# EAGLE design machxo2-breakout-v2 (EAGLE 9.4.2)
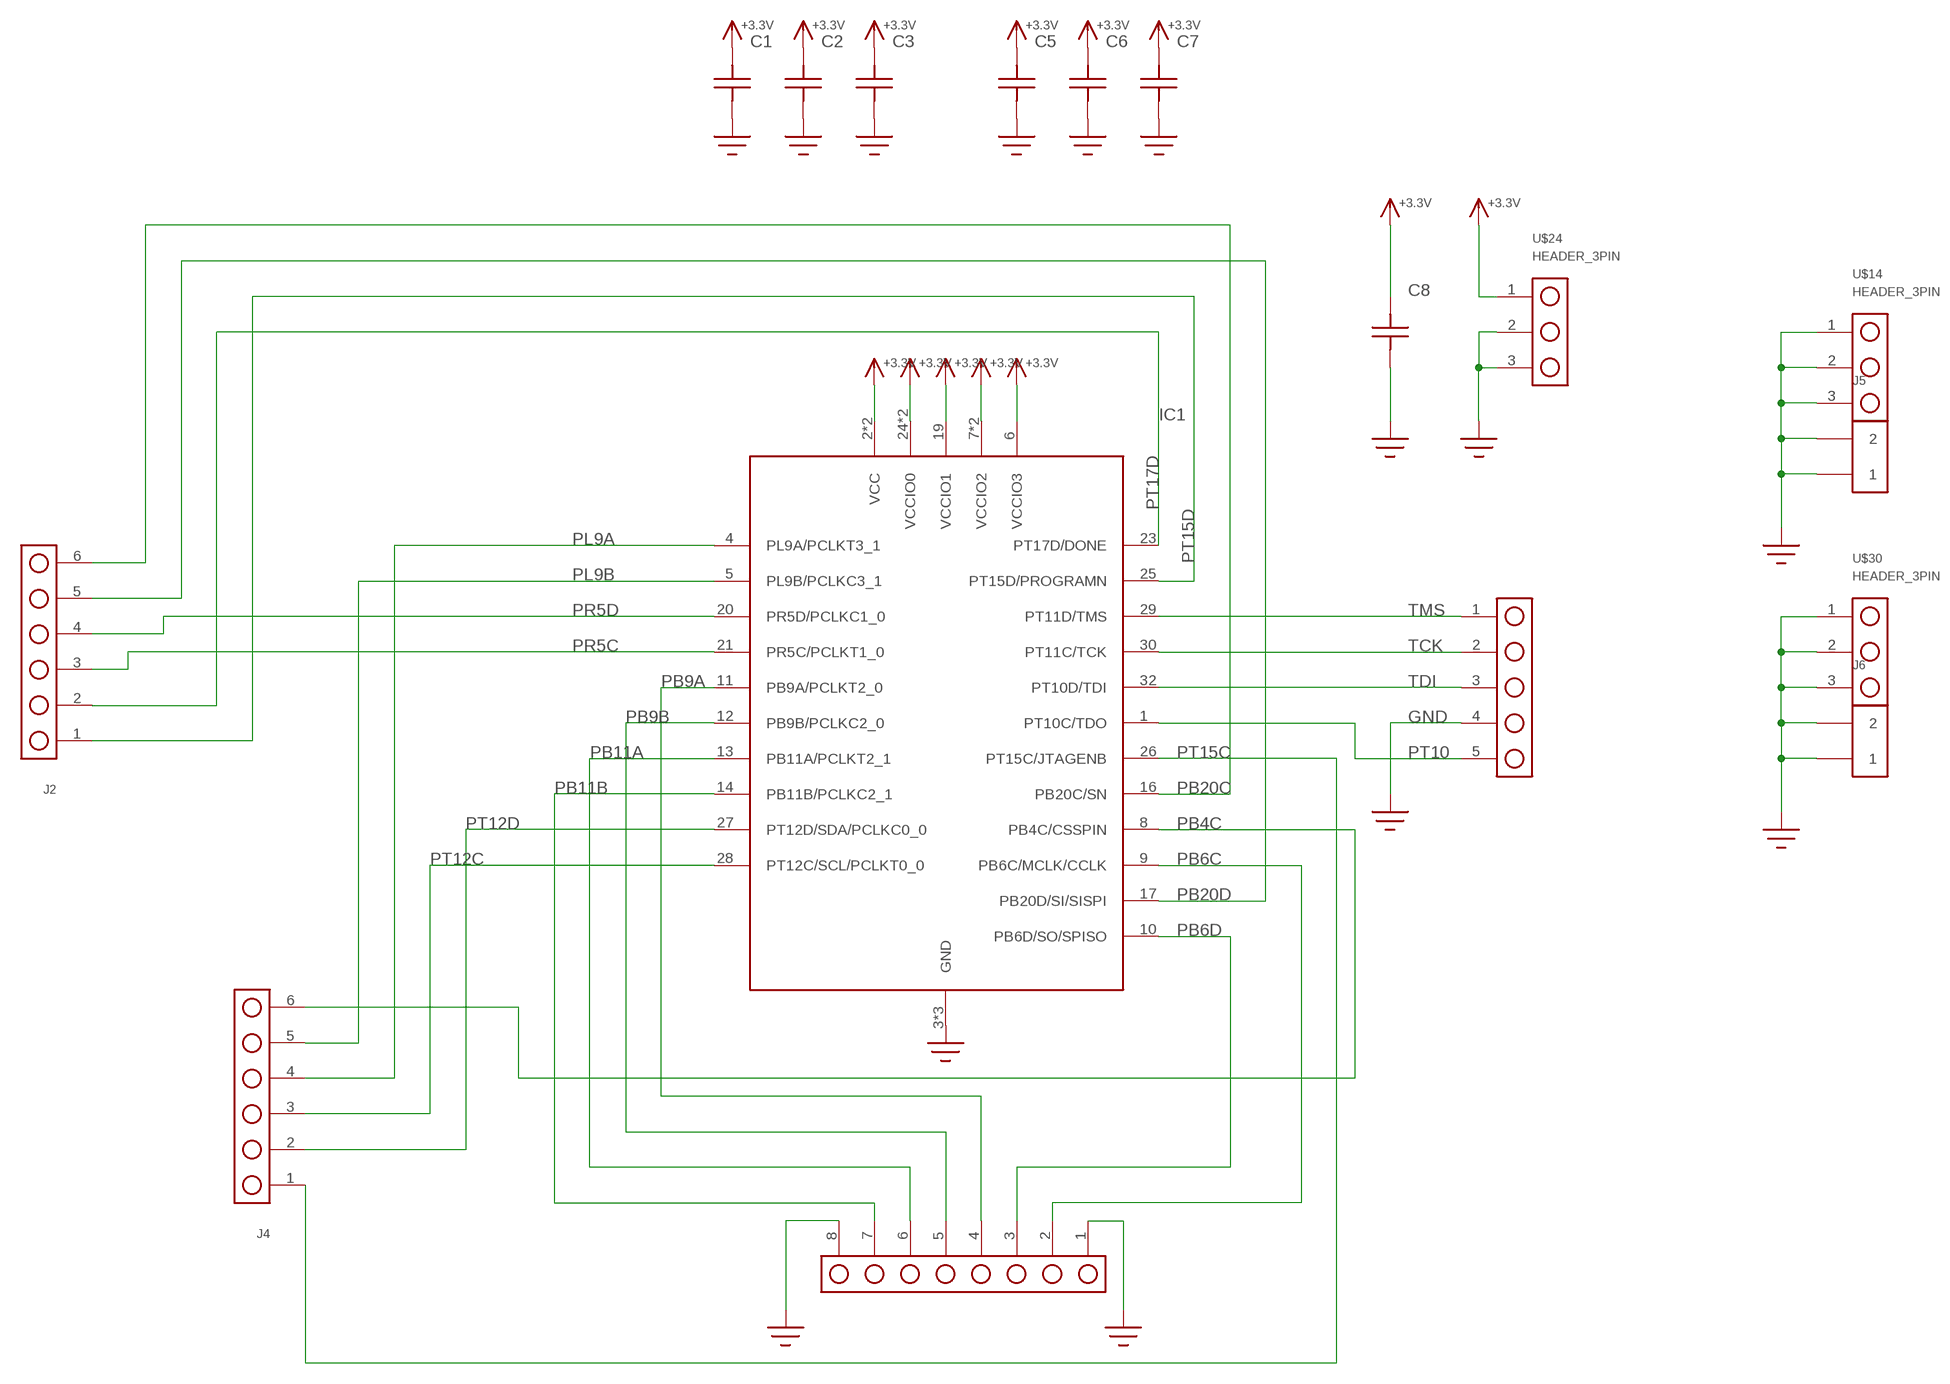
[diagram p0: schematic, sheet 1]

## Parts
C1  C  [C0402]
C2  C  [C0402]
C3  C  [C0402]
C5  C  [C0402]
C6  C  [C0402]
C7  C  [C0402]
C8  C1206  [1206]
IC1  MACHXO2_1200EXTENDED  [QFN32_5X5-EXTENDED]
J1  HEADER_5PIN  [HEADER_5PIN]
J2  HEADER_6PIN  [HEADER_6PIN]
J3  HEADER_8PIN  [HEADER_8_PIN]
J4  HEADER_6PIN  [HEADER_6PIN]
J5  HEADER_2PIN  [HEADER_2PIN]
J6  HEADER_2PIN  [HEADER_2PIN]
U$14  HEADER_3PIN  [HEADER_3PIN]
U$24  HEADER_3PIN  [HEADER_3PIN]
U$30  HEADER_3PIN  [HEADER_3PIN]

## Nets
+3.3V: C1.2 C2.2 C3.2 C5.2 C6.2 C7.2 C8.P$2 IC1.2(VCC) IC1.6(VCCIO3) IC1.7(VCCIO2) IC1.15(VCCIO2) IC1.18(VCC) IC1.19(VCCIO1) IC1.24(VCCIO0) IC1.31(VCCIO0) U$24.1
GND: C1.1 C2.1 C3.1 C5.1 C6.1 C7.1 C8.P$1 IC1.3(GND) IC1.22(GND) IC1.PAD(GND) J1.4 J3.1 J3.8 J5.1 J5.2 J6.1 J6.2 U$14.1 U$14.2 U$14.3 U$24.2 U$24.3 U$30.1 U$30.2 U$30.3
PB4C: IC1.8(PB4C/CSSPIN) J4.6
PB6C: IC1.9(PB6C/MCLK/CCLK) J3.2
PB6D: IC1.10(PB6D/SO/SPISO) J3.3
PB9A: IC1.11(PB9A/PCLKT2_0) J3.4
PB9B: IC1.12(PB9B/PCLKC2_0) J3.5
PB11A: IC1.13(PB11A/PCLKT2_1) J3.6
PB11B: IC1.14(PB11B/PCLKC2_1) J3.7
PB20C: IC1.16(PB20C/SN) J2.6
PB20D: IC1.17(PB20D/SI/SISPI) J2.5
PL9A: IC1.4(PL9A/PCLKT3_1) J4.4
PL9B: IC1.5(PL9B/PCLKC3_1) J4.5
PR5C: IC1.21(PR5C/PCLKT1_0) J2.3
PR5D: IC1.20(PR5D/PCLKC1_0) J2.4
PT10: IC1.1(PT10C/TDO) J1.5
PT12C: IC1.28(PT12C/SCL/PCLKT0_0) J4.3
PT12D: IC1.27(PT12D/SDA/PCLKC0_0) J4.2
PT15C: IC1.26(PT15C/JTAGENB) J4.1
PT15D: IC1.25(PT15D/PROGRAMN) J2.1
PT17D: IC1.23(PT17D/DONE) J2.2
TCK: IC1.30(PT11C/TCK) J1.2
TDI: IC1.32(PT10D/TDI) J1.3
TMS: IC1.29(PT11D/TMS) J1.1

## Library data of the parts
C1-C3 C5-C8 = yapo:C
IC1 = yapo:MACHXO2_1200
J1 = yapo:HEADER_5PIN
J2 J4 = yapo:HEADER_6PIN
J3 = yapo:HEADER_8PIN
J5 J6 = yapo:HEADER_2PIN
U$14 U$24 U$30 = yapo:HEADER_3PIN

## Board
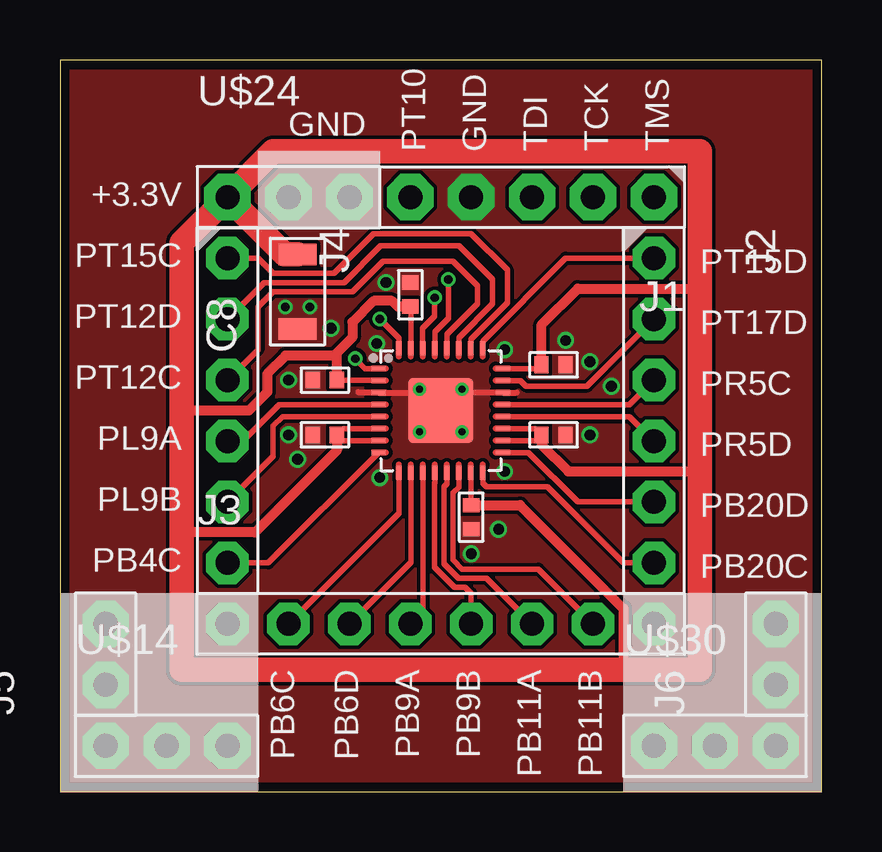
[diagram p1: board, top side]
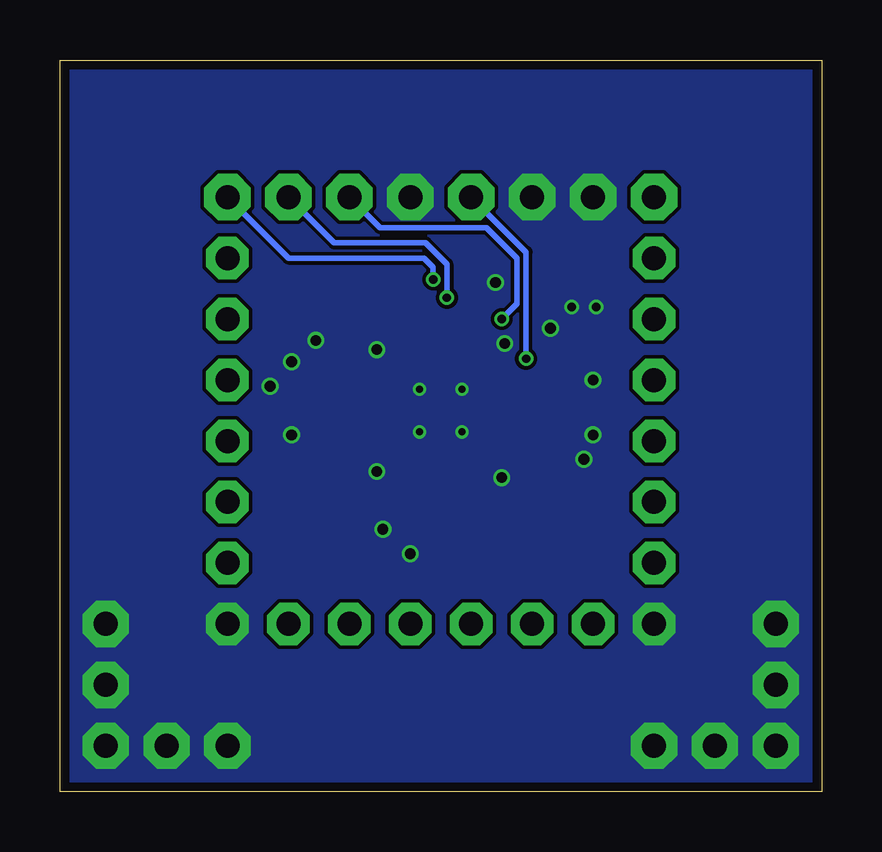
[diagram p2: board, bottom side, seen from below]

Size 31.75 x 30.48 mm. Coordinates in mm from the lower left corner, seen from the top.
Outline: 0,0 31.75,0 31.75,30.48 0,30.48 0,0
Copper layers (1*16): Top 0.035559375mm / dielectric 1.6mm / Bottom 0.035559375mm
Design rules "oshpark-2layer *": minimum track width 6mil, minimum drill 10mil, track to track 6mil, track to pad 6mil, pad to pad 6mil, via to via 6mil, smd to smd 6mil, copper to edge 15mil, drill to drill 6mil, minimum pad ring 5mil, minimum via ring 5mil, stop-mask expansion 2.5mil, vias tented up to drill 20mil, thermal gap 10mil

### Footprints (pad centres in the part's own frame; a part is rotated, then mirrored left to right if it is on the bottom)
C0402 = smd 0.6 x 0.7: 1 -0.5,0; 2 0.5,0
1206 = smd 0.9 x 1.6: P$1 -1.55,0; P$2 1.55,0
QFN32_5X5-EXTENDED = smd 0.6 x 0.24: 1 -2.594,1.75; 2 -2.594,1.25; 3 -2.594,0.75; 4 -2.594,0.25; 5 -2.594,-0.25; 6 -2.594,-0.75; 7 -2.594,-1.25; 8 -2.594,-1.75; 17 2.594,-1.75; 18 2.594,-1.25; 19 2.594,-0.75; 20 2.594,-0.25; 21 2.594,0.25; 22 2.594,0.75; 23 2.594,1.25; 24 2.594,1.75 | smd 0.24 x 0.6: 9 -1.75,-2.594; 10 -1.25,-2.594; 11 -0.75,-2.594; 12 -0.25,-2.594; 13 0.25,-2.594; 14 0.75,-2.594; 15 1.25,-2.594; 16 1.75,-2.594; 25 1.75,2.594; 26 1.25,2.594; 27 0.75,2.594; 28 0.25,2.594; 29 -0.25,2.594; 30 -0.75,2.594; 31 -1.25,2.594; 32 -1.75,2.594 | smd 2.7 x 2.7: PAD 0,0
HEADER_5PIN = drill 1 pad 1.93 octagon: 1 -5.08,0; 2 -2.54,0; 3 0,0; 4 2.54,0; 5 5.08,0
HEADER_6PIN = drill 1 pad 1.778 octagon: 1 -6.35,0; 2 -3.81,0; 3 -1.27,0; 4 1.27,0; 5 3.81,0; 6 6.35,0
HEADER_8_PIN = drill 1 pad 1.778 octagon: 1 -8.89,0; 2 -6.35,0; 3 -3.81,0; 4 -1.27,0; 5 1.27,0; 6 3.81,0; 7 6.35,0; 8 8.89,0
HEADER_2PIN = drill 1 pad 1.93 octagon: 1 -1.27,0; 2 1.27,0
HEADER_3PIN = drill 1 pad 1.93 octagon: 1 -2.54,0; 2 0,0; 3 2.54,0

### Placement (x,y rotation side)
C1  11.05,14.86 0 top
C2  11.05,17.14 0 top
C3  20.57,17.78 180 top
C5  14.61,20.7 270 top
C6  20.57,14.86 180 top
C7  17.14,11.43 90 top
C8  9.91,20.83 90 top
IC1  15.88,15.88 0 top
J1  19.68,24.77 180 top
J2  24.77,15.88 270 top
J3  15.88,6.99 0 top
J4  6.99,15.88 270 top
J5  1.91,5.71 90 top
J6  29.84,5.71 90 top
U$14  4.45,1.91 0 top
U$24  9.53,24.77 0 top
U$30  27.3,1.91 0 top

### Tracks (layer width: path | path; a pad name or v marks a point on that pad's centre or on a via)
+3.3V
  Top 0.229: IC1.31 14.62,20.18 C5.2 | IC1.2 13.26,17.14 C2.2 | IC1.24 19.92,17.62 C3.2 | IC1.18 19.84,14.62 C6.2 19.81,15.12 IC1.19 | IC1.6 11.81,15.12 C1.2 11.78,14.62 IC1.7 | IC1.15 17.14,13.26 C7.2
  Top 0.406: C2.2 11.55,18.28 11.56,18.29 | 11.56,18.29 11.43,18.16 9.4,18.16 8.64,17.4 8.64,16.64 7.87,15.88 5.08,15.88 | 11.56,18.29 11.68,18.41 12.19,18.92 12.19,19.56 13.08,20.45 13.84,20.45 14.09,20.2 C5.2 | C1.2 11.55,14.22 8.13,10.79 5.08,10.79 | C7.2 19.18,11.93 23.5,7.62 23.5,5.08 | C6.2 20.07,14.45 21.19,13.34 26.67,13.34 | C3.2 20.07,19.44 21.59,20.95 26.67,20.95
  Top 1.016: U$24.1 9.37,22.38 C8.P$2 | U$24.1 5.08,22.86 5.08,15.88 5.08,10.79 5.08,5.08 23.5,5.08 26.67,5.08 26.67,13.34 26.67,20.95 26.67,26.67 8.89,26.67 U$24.1
GND  (via drill 0.3, 0.35, 0.45)
  Top 0.254: v16.76,16.76 16.9,16.62 IC1.22 19.04,16.62 | v14.99,16.76 14.85,16.62 IC1.3 12.46,16.62 12.45,16.64
  other vias: 9.53,17.14 9.53,14.86 22.1,17.91 13.59,21.21 22.1,14.86 17.14,9.91 16.76,14.99 14.99,14.99 9.4,20.19 10.41,20.19 11.3,19.3 22.99,16.89 18.54,18.41 13.21,18.67 18.54,13.34 13.34,13.08 9.91,13.84 18.29,10.92 21.08,18.8
  pour Top (no thermals): 0,0 31.75,0 31.75,30.48 0,30.48
  pour Bottom (no thermals): 0,0 31.75,0 31.75,30.48 0,30.48
  cutout Top: 13.34,16.89 12.7,16.89 12.7,16.38 13.34,16.38
  cutout Top: 19.05,16.89 18.41,16.89 18.41,16.38 19.05,16.38
PB4C
  Top 0.229: IC1.8 8.68,9.53 J4.6
PB6C
  Top 0.229: IC1.9 14.12,11.59 J3.2
PB6D
  Top 0.229: IC1.10 14.62,9.54 J3.3
PB9A
  Top 0.229: IC1.11 15.12,7.5 J3.4
PB9B
  Top 0.229: J3.5 17.14,8.26 16.89,8.51 16.45,8.51 15.62,9.34 15.62,12.86 IC1.12
PB11A
  Top 0.229: J3.6 17.78,8.89 16.61,8.89 16,9.49 16,12.7 16.12,12.82 IC1.13
PB11B
  Top 0.229: IC1.14 16.62,12.69 16.38,12.45 16.38,9.65 16.76,9.27 19.94,9.27 J3.7
PB20C
  Top 0.229: IC1.16 17.62,12.86 17.78,12.7 20.32,12.7 23.5,9.53 J2.6
PB20D
  Top 0.229: IC1.17 19.53,14.12 21.59,12.06 J2.5
PL9A
  Top 0.229: IC1.4 9.14,16.12 7.62,14.61 J4.4
PL9B
  Top 0.229: IC1.5 9.28,15.62 8.89,15.24 8.89,13.97 J4.5
PR5C
  Top 0.229: IC1.21 23.75,16.12 J2.3
PR5D
  Top 0.229: IC1.20 23.75,15.62 J2.4
PT10  (via drill 0.35)
  Top 0.229: IC1.1 12.73,17.62 v12.32,18.03
  Bottom 0.229: v12.32,18.03 12.32,22.48 J1.5
PT12C
  Top 0.229: IC1.28 16.12,19.05 17.4,20.32 17.4,21.08 16.38,22.1 13.46,22.1 12.19,20.83 8.89,20.83 8.26,20.19 8.26,18.41 J4.3
PT12D
  Top 0.229: J4.2 8.51,21.21 11.84,21.21 13.37,22.73 16.64,22.73 18.03,21.34 18.03,20.32 16.62,18.91 IC1.27
PT15C
  Top 0.229: J4.1 8.26,22.23 8.89,21.59 11.43,21.59 13.08,23.24 17.14,23.24 18.65,21.74 18.65,20.37 17.12,18.85 IC1.26
PT15D
  Top 0.229: IC1.25 17.62,18.77 21.08,22.23 J2.1
PT17D
  Top 0.229: IC1.23 19.2,17.12 19.43,16.89 21.97,16.89 J2.2
TCK  (via drill 0.35)
  Top 0.229: v15.62,20.57 15.62,19.81 15.11,19.3 15.11,18.48 IC1.30
  Bottom 0.229: J1.2 20.32,22.86 16.51,22.86 15.62,21.97 v15.62,20.57
TDI  (via drill 0.35)
  Top 0.229: IC1.32 14.12,18.89 v13.34,19.68
  Bottom 0.229: J1.3 18.41,23.5 13.97,23.5 12.7,22.23 12.7,20.32 v13.34,19.68
TMS  (via drill 0.35)
  Top 0.229: v16.19,21.34 16.19,19.71 15.62,19.15 IC1.29
  Bottom 0.229: J1.1 22.23,22.23 16.58,22.23 16.19,21.84 v16.19,21.34

### Text on the board
tPlace: GND | PT10 | GND | TDI | TCK | TMS | +3.3V | PT15C | PT15D | PT12D | PT17D | PT12C | PR5C | PL9A | PR5D | PL9B | PB20D | PB4C | PB20C | PB6C | PB6D | PB9A | PB9B | PB11A | PB11B